# EAGLE design BTIR-v20 (EAGLE 4.16)
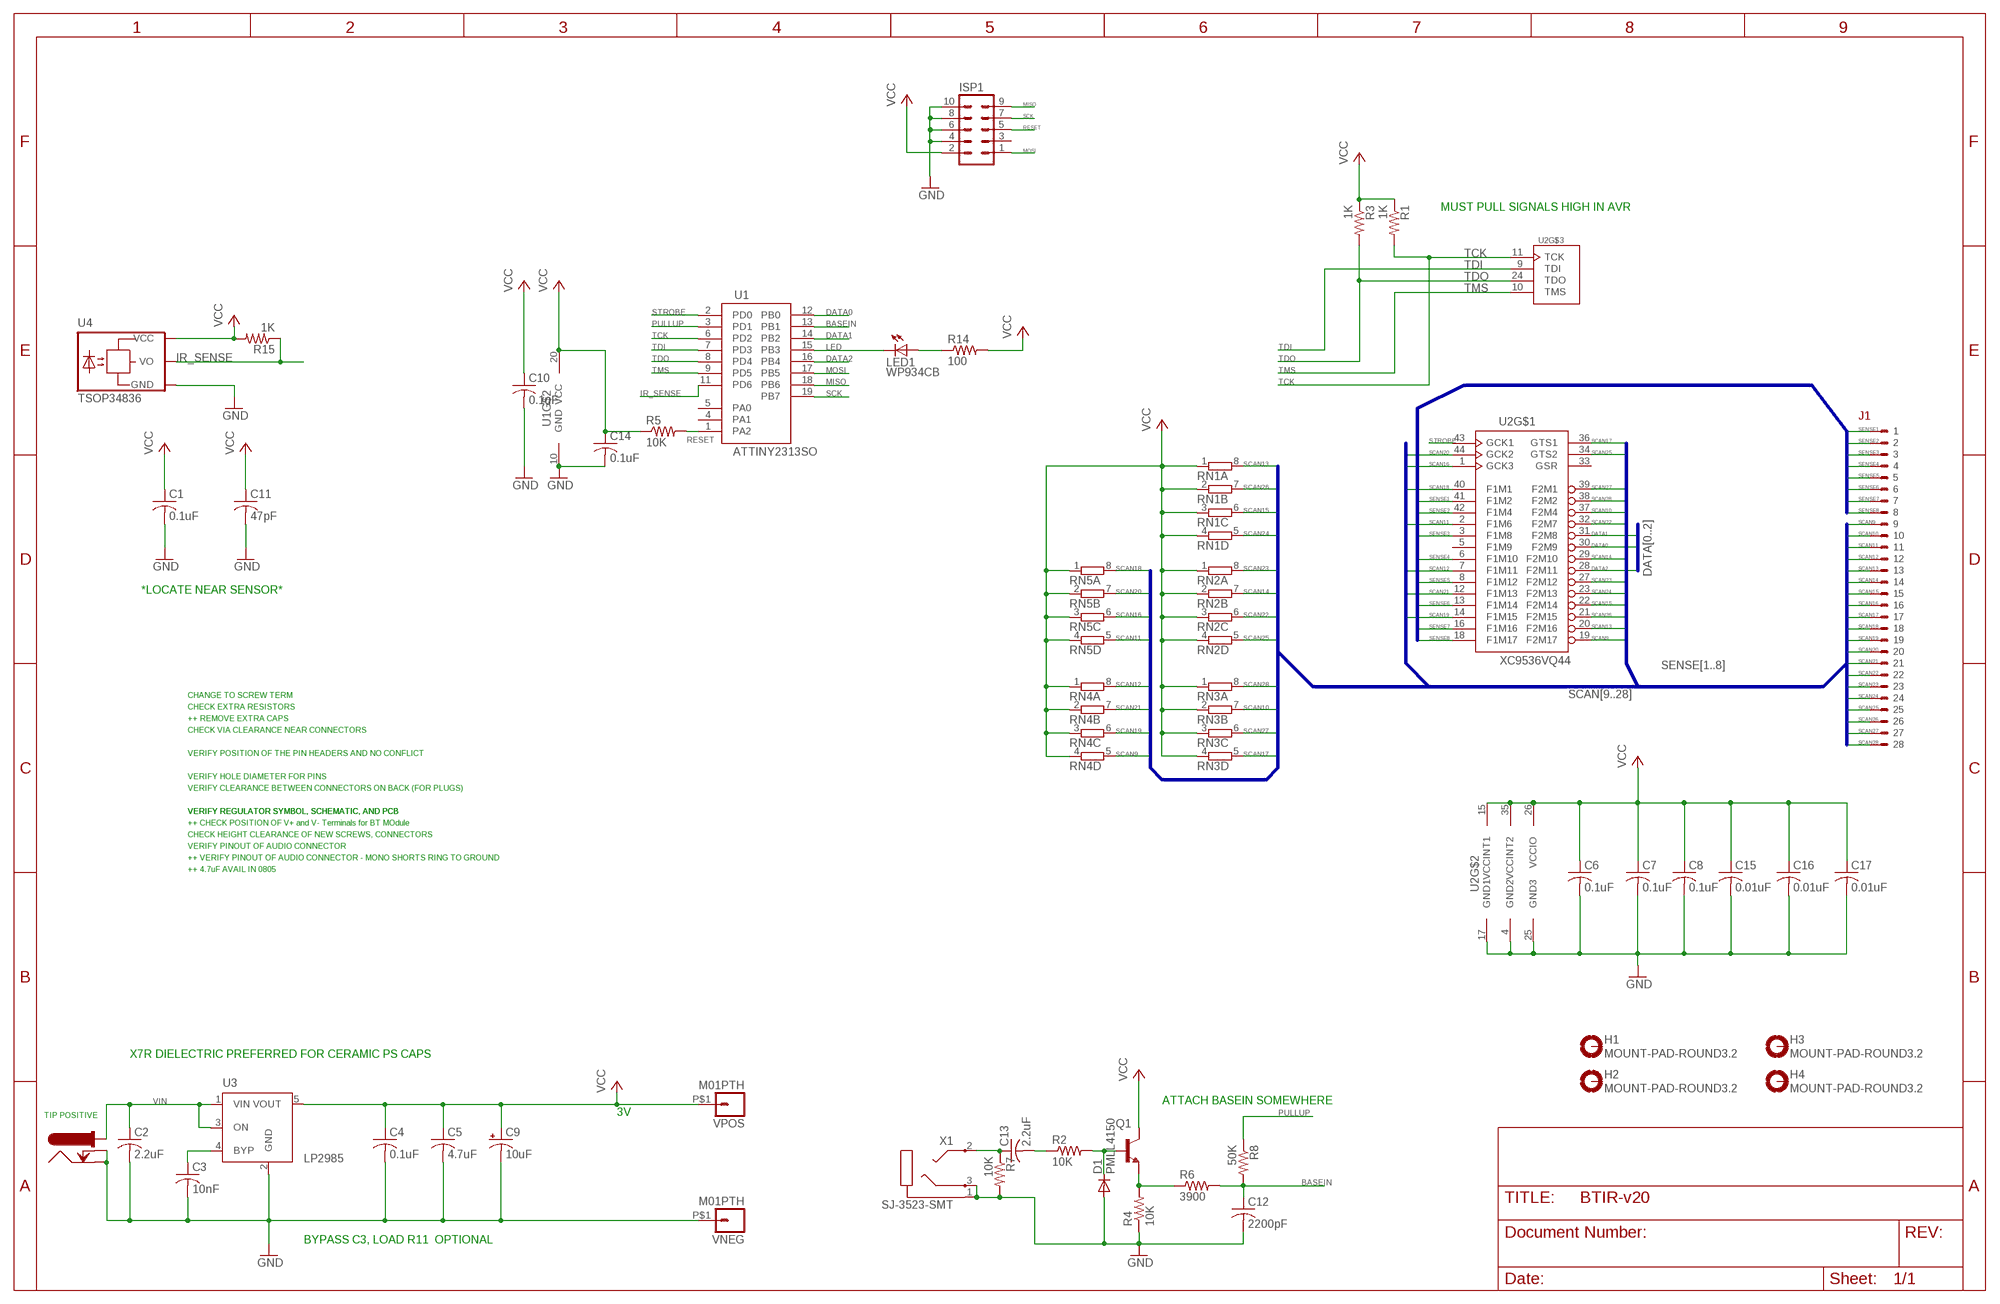
[diagram p0: schematic, sheet 1]

## Parts
C1  0.1uF  C-USC0805  [C0805]
C2  2.2uF  C-USC0805  [C0805]
C3  10nF  C-USC0805  [C0805]
C4  0.1uF  C-USC0805  [C0805]
C5  4.7uF  C-USC0805  [C0805]
C6  0.1uF  C-USC0805  [C0805]
C7  0.1uF  C-USC0805  [C0805]
C8  0.1uF  C-USC0805  [C0805]
C9  10uF  CPOL-USB  [PANASONIC_B]
C10  0.1uF  C-USC0805  [C0805]
C11  47pF  C-USC0805  [C0805]
C12  2200pF  C-USC0805  [C0805]
C13  2.2uF  C-USC0805  [C0805]
C14  0.1uF  C-USC0805  [C0805]
C15  0.01uF  C-USC0805  [C0805]
C16  0.01uF  C-USC0805  [C0805]
C17  0.01uF  C-USC0805  [C0805]
D1  PMLL4150  [SOD80C]
H1  MOUNT-PAD-ROUND3.2  [3,2-PAD]
H2  MOUNT-PAD-ROUND3.2  [3,2-PAD]
H3  MOUNT-PAD-ROUND3.2  [3,2-PAD]
H4  MOUNT-PAD-ROUND3.2  [3,2-PAD]
ISP1  MA05-2  [MA05-2]
J0  KOBICONN_163-021X-E  [KOBICONN_163-021X-E]
J1  MOLEX_52271-2879REV  [52271-2879]
LED1  WP934CB  [WP934CB]
Q1  TRANSISTOR_NPNSOT23  [SOT23]
R1  1K  R-US_R0805  [R0805]
R2  10K  R-US_R0805  [R0805]
R3  1K  R-US_R0805  [R0805]
R4  10K  R-US_R0805  [R0805]
R5  10K  R-US_R0805  [R0805]
R6  3900  R-US_R0805  [R0805]
R7  10K  R-US_R0805  [R0805]
R8  50K  R-US_R0805  [R0805]
R14  100  R-US_R0805  [R0805]
R15  1K  R-US_R0805  [R0805]
RN1  4R-N0603-ARC  [0603-ARC]
RN2  4R-N0603-ARC  [0603-ARC]
RN3  4R-N0603-ARC  [0603-ARC]
RN4  4R-N0603-ARC  [0603-ARC]
RN5  4R-N0603-ARC  [0603-ARC]
U1  ATTINY2313SO  [SOIC20S]
U2  XC9536VQ44  [VQ44]
U3  LP2985  [SOT23-5]
U4  TSOP34836  TSOP382XX  [VISHAY_TSOP_IR_LEADED]
VNEG  M01PTH  M01  [MACHINE_PIN_LARGE_RING]
VPOS  M01PTH  M01  [MACHINE_PIN_LARGE_RING]
X1  SJ-3523-SMT  [SJ-3523-SMT]

## Nets
BASEIN: C12.1 R6.2 R8.2 U1.13(PB1)
DATA0: U1.12(PB0) U2.30(F2M9)
DATA1: U1.14(PB2) U2.31(F2M8)
DATA2: U1.16(PB4) U2.28(F2M11)
GND: C1.2 C2.2 C3.2 C4.2 C5.2 C6.2 C7.2 C8.2 C9.- C10.2 C11.2 C12.2 C14.2 C15.2 C16.2 C17.2 D1.A ISP1.4 ISP1.6 ISP1.8 ISP1.10 J0.BARREL_2(BARREL) J0.SHUNT_1(SHUNT) R4.1 R7.2 U1.10(GND) U2.4(GND2) U2.17(GND1) U2.25(GND3) U3.2(GND) U4.2(GND) VNEG.P$1 X1.1(EARTH) X1.3(RING)
IR_SENSE: R15.1 U1.11(PD6) U4.1(VO)
LED: LED1.K(C) U1.15(PB3)
MISO: ISP1.9 U1.18(PB6)
MOSI: ISP1.1 U1.17(PB5)
N$1: C3.1 U3.4(BYP)
N$3: LED1.A R14.1
N$4: D1.C Q1.1(B) R2.2
N$5: C13.1 R7.1 X1.2(TIP)
N$6: Q1.2(E) R4.2 R6.1
N$7: C13.2 R2.1
PULLUP: R8.1 U1.3(PD1)
RESET: ISP1.5 R5.2 U1.1(PA2)
SCAN9: J1.20 RN4.5 U2.19(F2M17)
SCAN10: J1.19 RN3.7 U2.37(F2M4)
SCAN11: J1.18 RN5.5 U2.2(F1M6)
SCAN12: J1.17 RN4.8 U2.7(F1M11)
SCAN13: J1.16 RN1.8 U2.20(F2M16)
SCAN14: J1.15 RN2.7 U2.29(F2M10)
SCAN15: J1.14 RN1.6 U2.22(F2M14)
SCAN16: J1.13 RN5.6 U2.1(GCK3)
SCAN17: J1.12 RN3.5 U2.36(GTS1)
SCAN18: J1.11 RN5.8 U2.40(F1M1)
SCAN19: J1.10 RN4.6 U2.14(F1M15)
SCAN20: J1.9 RN5.7 U2.44(GCK2)
SCAN21: J1.8 RN4.7 U2.12(F1M13)
SCAN22: J1.7 RN2.6 U2.32(F2M7)
SCAN23: J1.6 RN2.8 U2.27(F2M12)
SCAN24: J1.5 RN1.5 U2.23(F2M13)
SCAN25: J1.4 RN2.5 U2.34(GTS2)
SCAN26: J1.3 RN1.7 U2.21(F2M15)
SCAN27: J1.2 RN3.6 U2.39(F2M1)
SCAN28: J1.1 RN3.8 U2.38(F2M2)
SCK: ISP1.7 U1.19(PB7)
SENSE1: J1.28 U2.41(F1M2)
SENSE2: J1.27 U2.42(F1M4)
SENSE3: J1.26 U2.3(F1M8)
SENSE4: J1.25 U2.6(F1M10)
SENSE5: J1.24 U2.8(F1M12)
SENSE6: J1.23 U2.13(F1M14)
SENSE7: J1.22 U2.16(F1M16)
SENSE8: J1.21 U2.18(F1M17)
STROBE: U1.2(PD0) U2.43(GCK1)
TCK: R1.2 U1.6(PD2) U2.11(TCK)
TDI: U1.7(PD3) U2.9(TDI)
TDO: R3.2 U1.8(PD4) U2.24(TDO)
TMS: U1.9(PD5) U2.10(TMS)
VCC: C1.1 C4.1 C5.1 C6.1 C7.1 C8.1 C9.+ C10.1 C11.1 C14.1 C15.1 C16.1 C17.1 ISP1.2 Q1.3(C) R1.1 R3.1 R5.1 R14.2 R15.2 RN1.1 RN1.2 RN1.3 RN1.4 RN2.1 RN2.2 RN2.3 RN2.4 RN3.1 RN3.2 RN3.3 RN3.4 RN4.1 RN4.2 RN4.3 RN4.4 RN5.1 RN5.2 RN5.3 RN5.4 U1.20(VCC) U2.15(VCCINT1) U2.26(VCCIO) U2.35(VCCINT2) U3.5(VOUT) U4.3(VCC) VPOS.P$1
VIN: C2.1 J0.PIN_3(PIN) U3.1(VIN) U3.3(ON)
Unconnected: H1.B3,2(MOUNT) H2.B3,2(MOUNT) H3.B3,2(MOUNT) H4.B3,2(MOUNT) ISP1.3 U1.4(PA1) U1.5(PA0) U2.5(F1M9) U2.33(GSR)

## Buses
SENSE[1..8]
SCAN[9..28]
DATA[0..2]

## Notes on the sheet
- MUST PULL SIGNALS HIGH IN AVR
- *LOCATE NEAR SENSOR*
- CHANGE TO SCREW TERM
- CHECK EXTRA RESISTORS
- ++ REMOVE EXTRA CAPS
- CHECK VIA CLEARANCE NEAR CONNECTORS
- VERIFY POSITION OF THE PIN HEADERS AND NO CONFLICT
- VERIFY HOLE DIAMETER FOR PINS
- VERIFY CLEARANCE BETWEEN CONNECTORS ON BACK (FOR PLUGS)
- VERIFY REGULATOR SYMBOL, SCHEMATIC, AND PCB | VERIFY REGULATOR SYMBOL, SCHEMATIC, AND PCB
- ++ CHECK POSITION OF V+ and V- Terminals for BT MOdule
- CHECK HEIGHT CLEARANCE OF NEW SCREWS, CONNECTORS
- VERIFY PINOUT OF AUDIO CONNECTOR
- ++ VERIFY PINOUT OF AUDIO CONNECTOR - MONO SHORTS RING TO GROUND
- ++ 4.7uF AVAIL IN 0805
- X7R DIELECTRIC PREFERRED FOR CERAMIC PS CAPS
- ATTACH BASEIN SOMEWHERE
- 3V
- TIP POSITIVE
- BYPASS C3, LOAD R11  OPTIONAL

## Library data of the parts
C1-C8 C10-C17 = rcl:C-US: CAPACITOR, American symbol
C9 = rcl:CPOL-US: POLARIZED CAPACITOR, American symbol
D1 = diode:PMLL4150: DIODE high speed
H1-H4 = holes:MOUNT-PAD-ROUND: MOUNTING PAD, round
ISP1 = con-lstb:MA05-2: PIN HEADER
J0 = ayman:KOBICONN_163-021X-E: Kobiconn laptop connector. NOTE: This connector is odd in that the insertion of the connector disconnects the shunt from the pin. With no plug inserted, the PIN is connected to the shunt. With plug inserted, the shunt is disconnected.
J1 = ayman:MOLEX_52271-2879
LED1 = ayman:WP934CB: Kingbright WP934CB Right Angle LED In plastic housing. 7.3mm height
Q1 = SparkFunEagle-6-6-07:TRANSISTOR_NPN: Transistor NPN BJT configuration in SOT23 package. MMBT2222 is the common NPN we use. Double check BCE configuration again layout.
R1-R8 R14 R15 = rcl:R-US_: RESISTOR, American symbol
RN1-RN5 = resistor-dil:4R-N: Array Chip Resistor Source: RS Component / Phycomp
U1 = ayman:ATTINY2313
U2 = ayman:XC9536
U3 = ayman:LP2985: Linear voltage regulators, 150mA, micropower, LDO up to 16V Vin SOT23-5 Package
U4 = ayman:TSOP382XX
VNEG VPOS = ayman:M01: "Mill-Max Machine Pin 316 Series"
X1 = con-cuistack:SJ-3523: 3.5 Stereo audio jack (SMT)

## Board
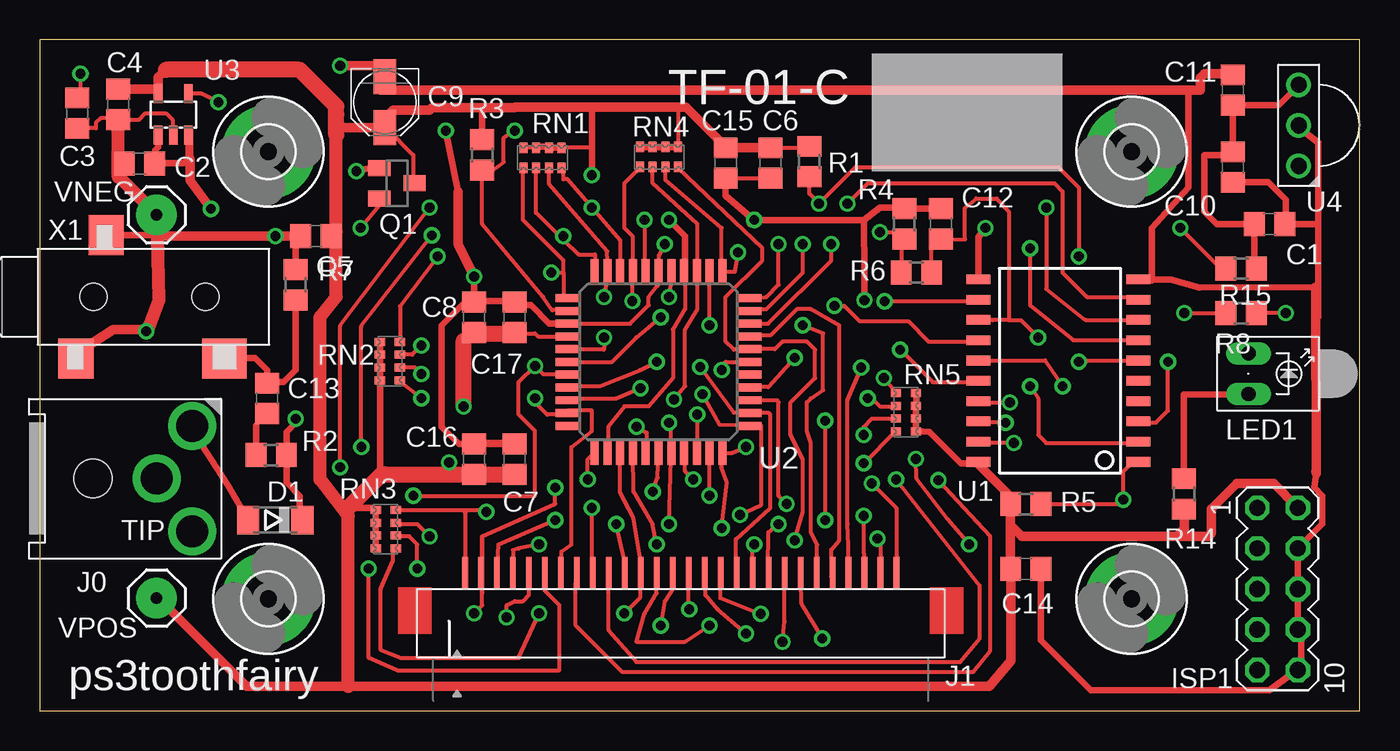
[diagram p1: board, top side]
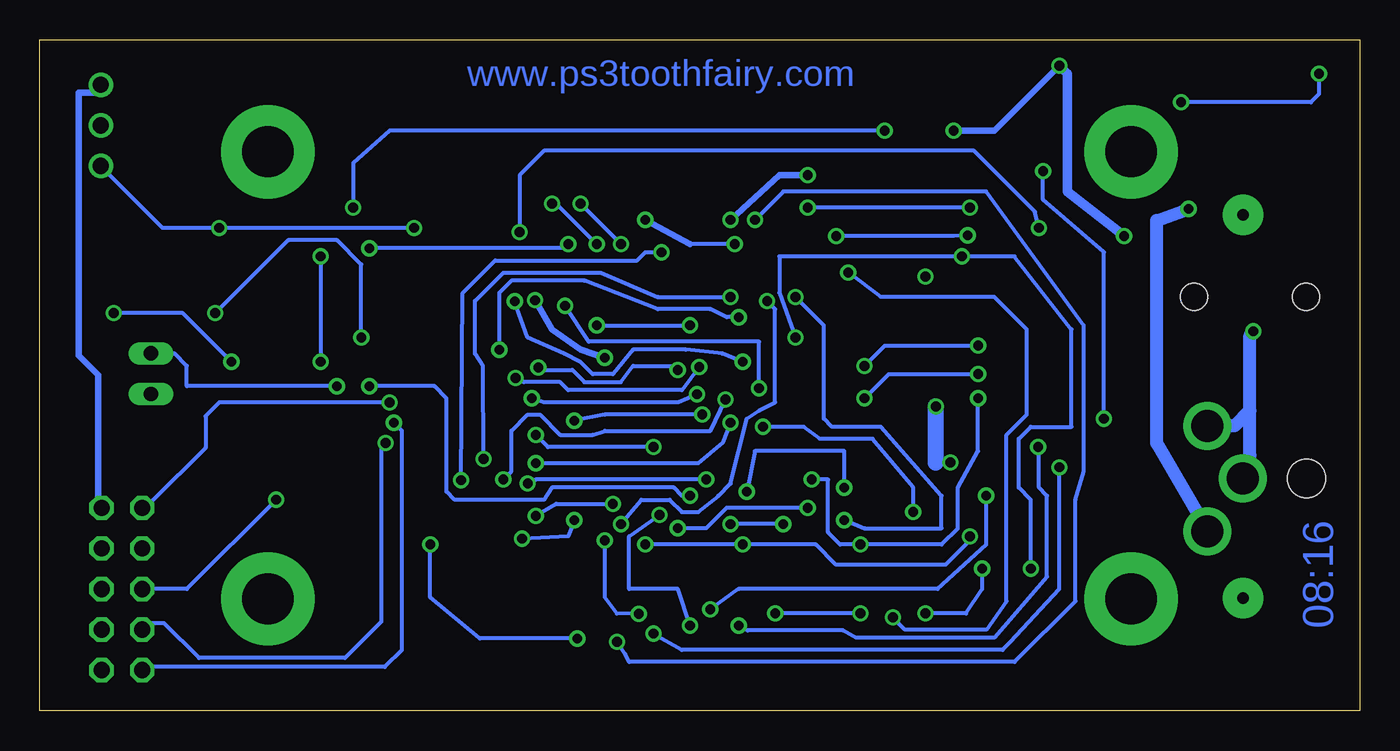
[diagram p2: board, bottom side, seen from below]

Size 82.6 x 42 mm. Coordinates in mm from the lower left corner, seen from the top.
Outline: 0,0 82.6,0 82.6,42 0,42 0,0
Copper layers (1*16): Top 0.035mm / dielectric 1.5mm / Bottom 0.035mm
Design rules "default": minimum track width 10mil, minimum drill 24mil, track to track 8mil, track to pad 8mil, pad to pad 8mil, via to via 8mil, smd to smd 8mil, copper to edge 40mil, drill to drill 8mil, minimum pad ring 10mil, minimum via ring 8mil, stop-mask expansion 4mil, vias tented up to drill 0mil, thermal gap 10mil

### Footprints (pad centres in the part's own frame; a part is rotated, then mirrored left to right if it is on the bottom)
C0805 = smd 1.3 x 1.5: 1 -0.95,0; 2 0.95,0
PANASONIC_B = smd 2.2 x 1.4: + 1.6,0; - -1.6,0
SOD80C = smd 1.4 x 1.8: A 1.7,0; C -1.7,0
3,2-PAD = drill 3.2 pad 5.842 round: B3,2 0,0
MA05-2 = drill 1.016 octagon: 1 -5.08,-1.27; 2 -5.08,1.27; 3 -2.54,-1.27; 4 -2.54,1.27; 5 0,-1.27; 6 0,1.27; 7 2.54,-1.27; 8 2.54,1.27; 9 5.08,-1.27; 10 5.08,1.27
KOBICONN_163-021X-E = drill 2 round: BARREL_2 3,0; PIN_3 5.2,-3.3; SHUNT_1 5.2,3.3 | hole 2.4: -1,0
52271-2879 = smd 0.35 x 2: 1 -30,2; 2 -29,2; 3 -28,2; 4 -27,2; 5 -26,2; 6 -25,2; 7 -24,2; 8 -23,2; 9 -22,2; 10 -21,2; 11 -20,2; 12 -19,2; 13 -18,2; 14 -17,2; 15 -16,2; 16 -15,2; 17 -14,2; 18 -13,2; 19 -12,2; 20 -11,2; 21 -10,2; 22 -9,2; 23 -8,2; 24 -7,2; 25 -6,2; 26 -5,2; 27 -4,2; 28 -3,2
WP934CB = drill 0.9 long: A -1.27,0; K 1.27,0
SOT23 = smd 1 x 1.4: 1 -0.95,-1.1; 2 0.95,-1.1; 3 0,1.1
R0805 = smd 1.3 x 1.5: 1 -0.95,0; 2 0.95,0
0603-ARC = smd 0.5 x 0.65: 1 -1.2,-0.625; 2 -0.4,-0.625; 3 0.4,-0.625; 4 1.2,-0.625; 5 1.2,0.625; 6 0.4,0.625; 7 -0.4,0.625; 8 -1.2,0.625
SOIC20S = smd 0.6 x 1.5: 1 -5.715,-5; 2 -4.445,-5; 3 -3.175,-5; 4 -1.905,-5; 5 -0.635,-5; 6 0.635,-5; 7 1.905,-5; 8 3.175,-5; 9 4.445,-5; 10 5.715,-5; 11 5.715,5; 12 4.445,5; 13 3.175,5; 14 1.905,5; 15 0.635,5; 16 -0.635,5; 17 -1.905,5; 18 -3.175,5; 19 -4.445,5; 20 -5.715,5
VQ44 = smd 1.5 x 0.5: 1 -5.7,4; 2 -5.7,3.2; 3 -5.7,2.4; 4 -5.7,1.6; 5 -5.7,0.8; 6 -5.7,0; 7 -5.7,-0.8; 8 -5.7,-1.6; 9 -5.7,-2.4; 10 -5.7,-3.2; 11 -5.7,-4; 23 5.7,-4; 24 5.7,-3.2; 25 5.7,-2.4; 26 5.7,-1.6; 27 5.7,-0.8; 28 5.7,0; 29 5.7,0.8; 30 5.7,1.6; 31 5.7,2.4; 32 5.7,3.2; 33 5.7,4 | smd 0.5 x 1.5: 12 -4,-5.7; 13 -3.2,-5.7; 14 -2.4,-5.7; 15 -1.6,-5.7; 16 -0.8,-5.7; 17 0,-5.7; 18 0.8,-5.7; 19 1.6,-5.7; 20 2.4,-5.7; 21 3.2,-5.7; 22 4,-5.7; 34 4,5.7; 35 3.2,5.7; 36 2.4,5.7; 37 1.6,5.7; 38 0.8,5.7; 39 0,5.7; 40 -0.8,5.7; 41 -1.6,5.7; 42 -2.4,5.7; 43 -3.2,5.7; 44 -4,5.7
SOT23-5 = smd 0.55 x 1.2: 1 -0.95,-1.3; 2 0,-1.3; 3 0.95,-1.3; 4 0.95,1.3; 5 -0.95,1.3
VISHAY_TSOP_IR_LEADED = drill 1.016 round: 1 -2.54,0; 2 0,0; 3 2.54,0
MACHINE_PIN_LARGE_RING = drill 0.711 pad 2.54 round: P$1 0,0
SJ-3523-SMT = smd 2.5 x 2.2: 1 3.85,-4.6; 3 -3.85,-2.7 | smd 2.5 x 2.8: 2 3.85,4.7 | hole 1.7: 0,-3.5; 0,3.5

### Placement (x,y rotation side)
C1  76.96,30.48 0 top
C2  6.23,34.26 180 top
C3  2.34,37.41 270 top
C4  4.91,37.96 270 top
C5  17.27,29.72 180 top
C6  45.72,34.29 270 top
C7  29.72,15.75 90 top
C8  27.18,24.64 90 top
C9  21.59,38.1 270 top
C10  74.68,34.04 270 top
C11  74.68,38.86 90 top
C12  56.39,30.48 90 top
C13  14.22,19.56 270 top
C14  61.71,8.87 0 top
C15  42.93,34.29 270 top
C16  27.18,15.75 90 top
C17  29.72,24.64 90 top
D1  14.73,11.94 180 top
H1  14.3,35 0 top
H2  14.3,7 0 top
H3  68.33,7 0 top
H4  68.33,35 0 top
ISP1  77.47,7.62 270 top
J0  4.32,14.53 0 top
J1  56.61,6.62 0 top
LED1  75.64,21.1 90 top
Q1  22.35,33.02 270 top
R1  48.16,34.39 270 top
R2  14.48,16 0 top
R3  27.69,34.8 270 top
R4  54.1,30.48 270 top
R5  61.71,12.94 0 top
R6  54.86,27.43 0 top
R7  16,26.67 90 top
R8  75.18,24.89 180 top
R14  71.61,13.58 270 top
R15  75.18,27.69 0 top
RN1  31.46,34.62 180 top
RN2  21.9,21.89 270 top
RN3  21.65,11.36 270 top
RN4  38.75,34.67 180 top
RN5  54.21,18.68 90 top
U1  63.75,21.29 90 top
U2  38.72,21.84 180 top
U3  8.35,37.33 0 top
U4  78.79,36.65 90 top
VNEG  7.3,31.05 0 top
VPOS  7.3,7.05 0 top
X1  6.85,25.92 270 top

### Tracks (layer width: path | path; a pad name or v marks a point on that pad's centre or on a via)
BASEIN  (via drill 0.61)
  Top 0.254: R6.2 55.81,28.89 56.39,29.46 | 60.64,24.45 60.64,31.24 59.88,32.07 58.61,32.07 57.91,31.5 57.91,29.53 56.39,29.46 | 56.39,29.46 C12.1 | U1.13 59.63,24.45 60.64,24.45 | 60.64,24.45 61.4,24.45 v62.48,23.37 | R8.2 74.17,24.89 v71.63,24.89
  Bottom 0.254: v62.48,23.37 62.48,27.94 64.01,29.46 67.06,29.46 v71.63,24.89
DATA0  (via drill 0.61)
  Top 0.254: v38.61,21.84 37.59,21.34 35.05,20.32 33.53,20.32 U2.30 | 58.75,25.73 U1.12 58.75,25.84 58.67,25.91 58.42,25.65 52.83,25.65 v52.88,25.63
  Bottom 0.254: v52.88,25.63 52.07,23.37 49.78,22.35 48.77,21.84 48.01,21.08 46.74,21.08 45.47,22.61 42.16,22.61 39.88,22.35 v38.61,21.84
DATA1  (via drill 0.61)
  Top 0.254: U2.31 33.53,19.56 36.07,19.56 v37.59,20.19 | v49.73,25.35 50.34,25.35 51.31,24.38 54.36,24.38 55.63,23.11 58.67,23.11 U1.14
  Bottom 0.254: v49.73,25.35 48.26,23.11 37.59,23.11 v37.59,20.19
DATA2  (via drill 0.61)
  Top 0.254: 32.51,21.84 U2.28 33.53,21.84 35.81,21.84 37.34,23.37 v38.86,24.64 | v53.85,22.61 55.88,20.57 58.67,20.57 U1.16
  Bottom 0.254: v38.86,24.64 39.62,24.64 40.64,25.15 43.94,25.15 48.51,26.92 53.09,26.92 53.85,26.16 v53.85,22.61
GND  (via drill 0.61)
  Top 0.254: 26.52,17.07 C16.2 27.69,16.76 | 26.52,25.3 C8.2 27.69,25.65 | U2.4 44.58,20.26 45.59,20.26 v47.24,22.1 | C7.2 29.21,16.76 | 29.21,25.65 C17.2 29.72,25.65 29.97,25.4 30.23,25.4 | 32.96,24.26 U2.25 36.94,24.24 38.1,25.4 38.1,25.91 38.67,26.61 38.67,27.62 38.72,27.57 U2.17 38.73,28.19 38.73,28.51 v39.12,29.21 | 45.91,33.34 C6.2 | C15.2 45.91,33.34 | 45.91,33.34 45.97,33.27 | C3.2 3.5,36.46 3.5,36.8 3.8,37.1 4.8,37.1 C4.2 6.21,37.01 6.6,37.4 7.9,37.4 8.3,37 8.3,36 8.33,36.03 U3.2 | 53.85,31.5 53.91,31.43 R4.1 | C12.2 56.39,31.5 56.32,31.43 | C9.- 21.59,38.86
  Top 0.406: 78.94,3.66 78.94,3.05 ISP1.10 | 29.21,16.76 27.69,16.76 | 27.69,25.65 29.21,25.65 | 30.23,25.4 30.73,25.4 31.88,24.26 32.96,24.26 32.97,24.24 U2.25 | 78.94,3.66 78.94,4.88 ISP1.8 ISP1.6 ISP1.4 80.26,11.68 80.26,13.46 79.76,13.97 79.88,14.86 79.76,14.99 | v27.18,27.18 27.18,26.16 | C7.2 26.23,16.7 25.15,17.78 25.15,24.13 27.18,26.16 | 27.18,26.16 C8.2 | C15.2 42.93,32.26 v44.7,30.73 | v51.61,25.7 51.61,27.38 51.56,30.73 | v44.7,30.73 44.45,30.48 | v44.7,30.73 51.56,30.73 | 78.94,3.66 78.94,2.74 76.96,1.27 65.79,1.27 62.66,4.4 C14.2 | v25.4,36.32 26.16,32.51 | 2.29,22.35 X1.1 | 51.56,30.73 52.58,31.5 53.85,31.5 | R4.1 56.32,31.43 | J0.SHUNT_1 9.45,17.83 9.4,17.78 11.76,14.15 D1.A | 78.79,36.63 U4.2 78.74,36.58 80.01,35.56 80.01,30.48 | 77.98,30.48 78.74,30.48 | 80.01,30.48 80.01,24.64 79.86,26.52 72.56,26.5 70.78,27.01 U1.10 69.6,26.92 69.6,30.23 71.88,32.77 71.88,38.86 | 80.01,30.48 77.98,30.48 | C10.2 76.9,33.09 77.98,32 77.98,30.48 | 77.98,30.48 C1.2 | X1.3 7.57,29.77 7.62,29.72 | 16,29.72 R7.2
  Top 0.61: 79.86,26.52 79.88,14.86 | 21.34,38.86 21.59,38.86 71.88,38.86 72.64,38.86 72.64,39.62 72.9,39.88 74.68,39.88 C11.2 | 26.16,32.51 26.16,29.21 v27.18,27.18 | 7.37,29.72 7.62,29.72 v14.73,29.72 16,29.72 C5.2 | 2.29,22.35 4.57,23.88 6.86,23.88 v6.65,23.75 | C9.- 21.59,39.88 21.08,40.39 v18.8,40.39
  Top 0.813: 4.91,34.2 4.91,33.39 4.96,33.39 VNEG.P$1 7.37,30.99 7.37,29.72 | 4.91,34.2 C4.2 | v6.65,23.75 6.7,23.7 7.46,25.7 7.37,29.72 | 4.91,34.2 4.9,34.2 4.96,34.26 C2.2 | 7.37,29.72 7.35,29.72
  Bottom 0.254: v39.12,29.21 41.91,29.21
  Bottom 0.406: 41.91,29.21 v44.7,30.73 | v47.24,22.1 48.77,22.61 50.55,23.88 v51.61,25.7 | v25.4,36.32 22.86,36.32 v18.8,40.39
  Bottom 0.61: v18.8,40.39 18.29,39.88 18.29,32.51 18.3,32.5 v14.73,29.72
  Bottom 0.813: J0.BARREL_2 7.32,14.43 7.37,14.22 6.86,16 6.86,18.8 | 6.86,18.8 6.86,23.5 v6.65,23.75 | 6.86,18.8 7.82,17.83 9.34,17.83 9.4,17.78 9.45,17.83 J0.SHUNT_1
IR_SENSE  (via drill 0.61)
  Top 0.254: R15.1 73.91,27.69 v71.37,30.23
  Top 0.406: U1.11 58.75,29.65 v59.18,30.23
  Bottom 0.254: v59.18,30.23 v71.37,30.23 74.93,30.23 78.79,34.09 U4.1
LED  (via drill 0.61)
  Top 0.254: U1.15 62.91,21.93 v64.01,20.32
  Bottom 0.254: v64.01,20.32 73.41,20.32 73.41,21.59 74.17,22.35 75.69,22.35 75.67,22.38 LED1.K
MISO  (via drill 0.61)
  Top 0.254: U1.18 58.75,18.11 58.67,18.03 v60.45,18.03
  Bottom 0.254: ISP1.9 75.59,2.74 61.01,2.74 59.94,3.81 59.94,17.53 v60.45,18.03
MOSI  (via drill 0.61)
  Top 0.254: U1.17 58.84,19.39 58.93,19.3 v60.71,19.3
  Bottom 0.254: ISP1.1 75.59,13.11 72.24,16.46 72.24,18.44 71.37,19.3 v60.71,19.3
N$1  (via drill 0.61)
  Top 0.254: U3.4 10.14,38.63 v11.18,38.1 | C3.1 2.55,38.87 2.54,38.86 v2.54,39.88
  Bottom 0.254: v11.18,38.1 3.05,38.1 2.54,38.61 v2.54,39.88
N$3
  Top 0.406: LED1.A 75.67,19.83 75.69,19.81 71.61,19.79 R14.1
N$4  (via drill 0.61)
  Top 0.254: 15.43,17.46 15.49,17.53
  Top 0.406: Q1.1 20.64,33.97 v19.81,33.78 | 15.49,17.53 16,18.03 v16,18.29 | 15.43,17.46 R2.2 15.43,14.29 16.26,13.46 16.26,11.94 D1.C
  Bottom 0.254: v16,18.29 16,28.7 19.81,32 v19.81,33.78
N$5
  Top 0.406: X1.2 11.65,22.07 11.68,22.1 13.46,22.1 14.22,21.34 C13.1 14.04,20.51 13.97,20.57 15.24,20.57 16,21.34 R7.1
N$6  (via drill 0.61)
  Top 0.254: R6.1 53.91,29.4 53.85,29.46 53.91,29.53 R4.2 54.1,29.46 53.59,29.97 v52.58,29.97 | Q1.2 21.25,31.67 v20.07,30.23
  Bottom 0.254: v20.07,30.23 20.32,31.24 24.13,35.05 51.05,35.05 52.58,33.53 v52.58,29.97
N$7
  Top 0.254: C13.2 14.22,18.54 13.53,17.85 | R2.1 13.46,16 13.53,16.07
  Top 0.406: 13.53,16.07 13.53,17.85
PULLUP  (via drill 0.61)
  Top 0.254: v70.61,21.84 70.61,18.8 69.85,18.03 68.83,18.03 U1.3 | v77.98,24.89 R8.1
  Bottom 0.254: v77.98,24.89 73.66,24.89 v70.61,21.84
RESET  (via drill 0.61)
  Top 0.254: U1.1 68.41,15.58 67.82,14.99 v67.82,13.21 67.55,12.94 R5.2
  Bottom 0.254: ISP1.5 73.41,7.62 v67.82,13.21
SCAN9  (via drill 0.61)
  Top 0.254: v37.08,25.65 37.08,26.92 U2.19 37.12,29.68 36.58,30.23 36.58,33.02 37.59,34.04 RN4.5 | v46.23,11.68 45.59,11.18 45.57,9.02 J1.20
  Bottom 0.254: v46.23,11.68 44.96,13.21 43.18,13.21 42.42,12.45 41.4,12.45 40.13,13.46 39.37,14.22 38.35,18.29 37.59,18.8 36.58,19.3 36.58,25.15 v37.08,25.65
SCAN10  (via drill 0.61)
  Top 0.254: v38.61,10.41 38.35,11.68 37.15,13.72 U2.37 | v44.7,10.41 44.58,10.16 J1.19 | RN3.7 22.35,11.68 23.62,11.68 v24.38,10.92
  Bottom 0.254: v44.7,10.41 v38.61,10.41 34.04,10.41 32.77,9.14 25.91,9.14 24.38,10.67 v24.38,10.92
SCAN11  (via drill 0.61)
  Top 0.254: J1.18 43.56,9.78 43.56,10.73 45.72,12.7 45.72,18.54 45.62,18.64 U2.2 44.54,18.64 44.58,18.61 | v52.83,20.83 RN5.5 | v41.34,21.53 43.43,18.67 44.58,18.61 | 44.58,18.61 44.64,18.54
  Bottom 0.254: v52.83,20.83 52.32,20.57 50.04,20.57 49.53,20.07 42.42,20.07 v41.34,21.53
SCAN12  (via drill 0.61)
  Top 0.254: v45.11,6.07 42.6,7.06 42.6,8.18 J1.17 | v47.24,10.67 47.75,12.45 47.75,15.75 46.99,17.27 46.99,19.3 48.51,20.83 48.51,22.61 48.01,23.11 46.48,23.11 46.01,22.64 U2.7 44.7,22.61 43.43,22.61 42.93,23.11 42.93,25.91 45.21,28.19 45.21,28.96 39.95,33.96 RN4.8
  Bottom 0.254: v47.24,10.67 47.24,7.11 46.48,6.1 v45.11,6.07
SCAN13  (via drill 0.61)
  Top 0.254: v24.38,31.5 18.8,24.13 v18.8,15.24 | v44.2,4.83 42.42,6.35 41.66,7.24 41.66,8.64 41.64,8.62 J1.16 | 32.64,34.04 32.62,34.04 RN1.8 32.66,34.02 32.64,34.04 | 32.64,34.04 32.77,34.04 | U2.20 36.32,27.94 36.32,29.46 v34.54,31.5 33.02,33.27 32.77,33.27 32.77,33.91 32.64,34.04
  Bottom 0.254: v18.8,15.24 18.8,7.62 21.84,4.32 22.35,3.81 42.42,3.81 v44.2,4.83 | v24.38,31.5 v34.54,31.5
SCAN14  (via drill 0.61)
  Top 0.254: U2.29 32.81,21.04 32.77,21.08 31.5,21.08 v30.99,21.59 29.97,20.57 29.97,18.54 30.99,17.53 30.99,13.46 v23.37,13.46 | v40.64,6.35 40.61,6.83 40.64,8.64 J1.15 | RN2.7 23.3,22.29 v23.88,22.86
  Bottom 0.254: v23.88,22.86 29.72,22.86 v30.99,21.59 | v23.37,13.46 23.37,10.41 26.42,7.62 38.86,7.62 v40.64,6.35
SCAN15  (via drill 0.61)
  Top 0.254: v24.54,29.77 20.12,24.08 v20.12,16.51 | J1.14 39.62,7.92 39.62,7.62 39.12,6.86 v38.86,5.33 | U2.22 34.73,28.57 33.72,28.57 32.77,29.46 | RN1.6 31.05,33.86 31.05,31.18 32.77,29.46 | v32.77,29.72 32.77,29.46
  Bottom 0.254: v24.54,29.77 25.4,29.72 v32.77,29.72 | v38.86,5.33 38.3,5.03 32.31,5.03 31.5,4.57 22.86,4.57 19.56,8.38 19.56,13.46 20.07,13.97 20.07,16.51 v20.12,16.51
SCAN16  (via drill 0.61)
  Top 0.254: 43.94,17.78 U2.1 45.15,17.84 | J1.13 38.61,7.87 38.61,7.37 37.85,6.1 37.34,4.32 40.39,4.32 v41.91,5.33 | 45.15,17.84 45.15,12.89 v43.81,12.26 | v51.82,19.56 52.07,19.56 52.58,19.05 53.59,19.05 53.58,19.06 RN5.6 | 45.15,17.84 42.55,17.91 v41.47,19.81
  Bottom 0.254: v43.81,12.26 45.72,10.92 45.72,7.62 42.67,7.62 v41.91,5.33 | v41.47,19.81 42.67,19.3 51.05,19.3 v51.82,19.56
SCAN17  (via drill 0.61)
  Top 0.254: U2.36 36.32,15.49 36.32,13.65 37.15,12.06 37.59,9.4 J1.12 37.59,8.64 37.59,7.11 v36.58,6.1 | v31.24,6.1 29.97,3.3 22.61,3.3 21.34,3.81 21.34,7.62 22.1,9.4 22.1,9.91 22.35,10.16 RN3.5
  Bottom 0.254: v31.24,6.1 v36.58,6.1
SCAN18  (via drill 0.61)
  Top 0.254: v39.37,11.68 39.5,15.75 | v36.07,11.68 36.58,9.4 J1.11 | 39.5,15.75 U2.40 | 39.5,15.75 39.5,17.59 v39.37,18.03 | 53.58,17.52 53.59,17.53 | 53.58,17.52 RN5.8 | v51.56,15.49 53.58,17.52
  Bottom 0.254: v36.07,11.68 v39.37,11.68 | v39.37,18.03 39.88,16.76 41.4,15.49 v51.56,15.49
SCAN19  (via drill 0.61)
  Top 0.254: J1.10 35.6,8.43 35.6,5.04 37.34,3.05 57.61,3.05 58.83,4.52 58.83,7.82 53.65,14.43 v53.59,14.48 | RN4.6 38.35,33.02 41.15,30.48 41.15,27.69 41.12,27.66 U2.14 41.15,26.42 41.15,25.15 40.39,23.88 40.39,20.32 v39.69,19.49
  Bottom 0.254: v53.59,14.48 53.09,14.99 53.09,17.53 52.07,18.54 51.31,18.54 50.04,17.27 48.01,17.27 47.24,17.53 40.64,17.53 v39.69,19.49
SCAN20  (via drill 0.61)
  Top 0.254: v34.54,12.7 34.54,9.4 J1.9 | v42.67,11.43 42.99,14.29 42.67,15.24 42.67,15.49 U2.44 43.32,16.14 v44.2,16.51 | v51.56,17.27 51.56,17.78 52.07,18.29 53.59,18.29 RN5.7
  Bottom 0.254: v42.67,11.43 40.89,11.43 39.62,12.7 v34.54,12.7 | v44.2,16.51 50.8,16.51 v51.56,17.27
SCAN21  (via drill 0.61)
  Top 0.254: v56.24,14.43 59.49,10.92 59.49,3.76 58.42,2.44 36.42,2.44 33.53,5.33 33.53,7.92 J1.8 | RN4.7 39.15,33.24 42.67,30.23 42.67,27.43 42.72,27.48 | 42.72,27.48 U2.12 | 42.72,27.48 43.48,27.48 v43.69,28.7
  Bottom 0.254: v56.24,14.43 56.13,26.16 54.1,28.19 45.21,28.19 44.7,28.7 v43.69,28.7
SCAN22  (via drill 0.61)
  Top 0.254: J1.7 32.64,9.02 32.64,9.97 33.27,10.41 33.27,16.51 34.54,17.53 34.54,18.8 33.02,18.8 U2.32 32.51,18.54 31.75,18.54 30.99,19.3 v30.99,19.56 | RN2.6 23.47,21.49 v23.88,21.08
  Bottom 0.254: v23.88,21.08 29.46,21.08 v30.99,19.56
SCAN23  (via drill 0.61)
  Top 0.254: v35.31,23.37 35.31,22.61 33.53,22.61 U2.27 | v20.57,8.89 20.57,3.3 22.35,2.54 32.51,2.54 32.51,6.6 31.61,7.51 J1.6 | RN2.8 22.53,25.32 v24.89,28.45
  Bottom 0.254: v35.31,23.37 36.32,26.16 36.32,28.45 v24.89,28.45 21.59,28.45 18.03,23.88 18.03,17.78 20.57,17.78 21.34,17.02 21.34,13.97 20.57,13.21 v20.57,8.89
SCAN24  (via drill 0.61)
  Top 0.254: RN1.5 30.23,33.96 30.23,30.73 32.77,28.19 32.77,27.43 | U2.23 32.95,25.91 32.77,25.91 32.77,27.43 | v32,27.43 32.77,27.43 | J1.5 30.61,7.24 30.23,6.86 29.72,6.86 29.21,6.6 v29.21,5.84
  Bottom 0.254: v32,27.43 29.97,25.91 22.86,25.91 20.83,23.88 20.83,18.54 22.1,17.27 22.1,6.86 23.37,5.08 28.45,5.08 v29.21,5.84
SCAN25  (via drill 0.61)
  Top 0.254: 34.54,15.49 U2.34 34.72,16.18 | RN2.5 22.78,20.4 v23.88,19.56 | 34.72,16.18 34.8,16.26 | v34.29,14.48 34.29,15.75 34.72,16.18 | J1.4 29.61,10.05 29.97,10.16 v31.24,10.41
  Bottom 0.254: v34.29,14.48 33.27,14.48 33.27,11.18 32.51,10.41 v31.24,10.41 26.16,10.41 25.15,11.43 25.15,13.97 23.88,16.26 v23.88,19.56
SCAN26  (via drill 0.61)
  Top 0.254: v35.31,25.91 35.5,26.8 U2.21 35.56,27.5 | RN1.7 31.88,33.95 31.88,32.96 35.5,28.77 35.56,27.5 | 35.56,27.5 35.56,27.43 | J1.3 28.7,10.41 v32.26,11.94
  Bottom 0.254: v32.26,11.94 30.99,11.43 26.16,11.43 26.16,13.46 29.97,17.78 33.02,17.78 33.53,18.29 33.53,24.13 v35.31,25.91
SCAN27  (via drill 0.61)
  Top 0.254: v38.35,13.72 38.67,14.61 U2.39 | 27.69,9.4 J1.2 27.67,8.62 27.69,8.64 | 27.69,10.92 27.69,9.4 | 27.69,10.92 32.26,12.95 v32.26,13.97 | 27.69,9.4 27.69,7.37 | RN3.6 22.31,10.96 22.35,10.92 23.11,10.92 23.62,10.41 v23.62,8.89 | 27.69,10.92 27.69,6.6 v27.18,6.1
  Bottom 0.254: v38.35,13.72 37.85,16.26 32.26,16.26 v32.26,13.97 | v27.18,6.1 24.64,6.1 23.62,7.62 v23.62,8.89
SCAN28  (via drill 0.61)
  Top 0.254: v37.34,17.78 37.97,17.4 U2.38 | RN3.8 26.67,12.56 | 26.67,12.56 27.82,12.56 v27.94,12.45 | 26.67,12.56 26.67,12.45 26.61,12.39 J1.1
  Bottom 0.254: v37.34,17.78 34.8,17.78 33.78,17.02 30.48,17.02 27.94,13.97 v27.94,12.45
SCK  (via drill 0.61)
  Top 0.254: U1.19 58.75,16.84 58.67,16.76 v60.96,16.76
  Bottom 0.254: ISP1.7 75.59,5.49 74.83,5.49 72.64,3.3 63.5,3.3 61.21,5.59 61.21,16.51 v60.96,16.76
SENSE1  (via drill 0.61)
  Top 0.254: v40.89,14.48 40.39,14.99 40.39,15.49 U2.41 | J1.28 53.61,12.68 v52.07,14.22
  Bottom 0.254: v40.89,14.48 51.56,14.48 51.82,14.22 v52.07,14.22
SENSE2  (via drill 0.61)
  Top 0.254: v52.43,10.77 52.6,10.78 52.6,9.4 J1.27 | v49.15,18.16 v49.15,11.94 | U2.42 41.15,16.76 v41.15,18.54
  Bottom 0.254: v49.15,11.94 49.53,10.92 v52.43,10.77 | v41.15,18.54 47.24,18.54 v49.15,18.16
SENSE3  (via drill 0.61)
  Top 0.254: v51.56,12.19 51.56,9.96 51.64,9.47 J1.26 | 44.96,19.3 U2.3 46.13,19.43 46.23,19.3 46.23,13.46 v46.74,12.95
  Bottom 0.254: v46.74,12.95 50.29,12.95 v51.56,12.19
SENSE4  (via drill 0.61)
  Top 0.254: J1.25 50.6,9.45 50.6,10.36 50.55,11.68 50.55,19.46 v51.41,21.49 | v42.67,21.34 42.67,21.59 42.93,21.84 44.45,21.84 U2.6
  Bottom 0.254: v42.67,21.34 42.93,21.59 45.47,21.59 46.23,20.57 48.51,20.57 49.28,21.34 51.31,21.34 v51.41,21.49
SENSE5
  Top 0.254: 44.45,23.37 U2.8 44.42,23.46 44.45,23.5 45.72,23.5 47.37,25.15 48.26,25.15 50.04,24.13 50.04,10.67 49.53,10.08 49.55,8.36 J1.24
SENSE6  (via drill 0.61)
  Top 0.254: U2.13 41.91,27.43 v41.91,24.13 | v47.75,24.13 49.02,23.62 49.02,20.07 48.26,19.56 48.01,19.3 48.01,17.53 48.26,16.76 48.26,11.18 48.64,10.41 48.64,8.64 J1.23
  Bottom 0.254: v47.75,24.13 v41.91,24.13
SENSE7  (via drill 0.61)
  Top 0.254: v54.84,15.76 54.86,14.53 56.82,11.99 v58.17,10.41 | v48.97,4.52 47.68,6.71 47.62,8.15 J1.22 | v39.37,25.91 39.5,26.67 U2.16
  Bottom 0.254: v39.37,25.91 43.94,25.91 47.5,27.43 53.59,27.43 55.37,25.65 55.37,22.35 54.86,21.59 v54.84,15.76 | v48.97,4.52 55.07,4.52 58.17,7.11 v58.17,10.41
SENSE8  (via drill 0.61)
  Top 0.254: v37.85,30.73 37.85,28.19 U2.18 | v46.48,4.32 46.61,5.59 J1.21
  Bottom 0.254: v37.85,30.73 36.07,32.51 23.37,32.51 17.27,24.13 17.27,14.99 17.78,13.21 17.78,6.86 21.59,3.05 45.72,3.05 45.97,3.56 v46.48,4.32
STROBE  (via drill 0.61)
  Top 0.254: U2.43 41.92,13.73 v41.91,13.46 | v61.98,20.32 62.48,19.56 62.48,17.27 62.99,16.76 68.58,16.76 U1.2
  Bottom 0.254: v41.91,13.46 42.42,13.46 42.93,13.97 50.55,13.97 51.05,13.21 56.64,13.21 57.15,13.72 57.15,19.56 57.91,20.32 v61.98,20.32
TCK  (via drill 0.61)
  Top 0.254: U2.11 45.47,25.91 46.23,26.67 v46.23,29.21 | v65.02,21.84 65.11,21.93 U1.6 | U1.6 | U1.6 68.83,21.84 | v65.02,28.45 65.02,32.77 63.75,34.04 51.05,34.04 v48.77,31.75 48.16,32.36 R1.2
  Bottom 0.254: v46.23,29.21 v48.77,31.75 | v65.02,28.45 v65.02,21.84
TDI  (via drill 0.61)
  Top 0.254: v49.53,29.21 49.53,28.19 45.58,24.24 U2.9 | U1.7 64.69,23.2 61.98,25.4 v61.98,28.96
  Bottom 0.254: v61.98,28.96 49.78,28.96 v49.53,29.21
TDO  (via drill 0.61)
  Top 0.254: U1.8 68.83,24.38 | U1.8 | U1.8 65.45,24.47 62.99,26.42 v62.99,31.5 | v29.72,36.32 29.02,35.88 29.02,34.36 27.94,33.53 27.69,33.78 R3.2 | R3.2 27.69,34.04 | R3.2 27.69,30.48 31.5,25.91 32.07,25.08 32.89,25.08 32.96,25.02 32.98,25.04 U2.24
  Bottom 0.254: v62.99,31.5 62.99,34.29 60.71,36.32 v29.72,36.32
TMS  (via drill 0.61)
  Top 0.254: U2.10 44.96,25.15 45.47,25.15 47.75,27.43 v47.75,29.21 | U1.9 68.83,25.65 | U1.9 | U1.9 68.58,25.91 65.53,25.91 64.01,27.43 64.01,32.51 63.5,33.02 51.82,33.02 v50.55,31.75
  Bottom 0.254: v50.55,31.75 50.29,31.75 v47.75,29.21
VCC  (via drill 0.61)
  Top 0.254: 27.13,14.73 27.13,14.63 C16.1 27.69,14.73 29.21,14.73 C7.1 | 26.52,23.16 C8.1 27.69,23.62 | 25.6,14.73 25.6,14.63 | U2.35 35.56,16.76 35.56,17.78 36.58,19.05 38.1,19.05 39.62,20.83 39.62,23.88 40.39,25.15 40.39,26.92 U2.15 | 29.21,23.62 C17.1 30.23,23.62 30.99,23.62 31.18,23.43 32.96,23.43 33.02,23.37 U2.26 | R1.1 48.23,35.34 48.26,35.31 48.19,35.24 C6.1 | C9.+ 21.67,36.5 23.37,34.8 23.37,33.02 Q1.3 | 39.88,37.78 39.88,37.85 39.91,37.81 | 39.91,37.81 39.95,37.77 39.94,37.77 | RN1.3 31.05,35.24 30.99,35.31 30.93,35.24 RN1.4 | RN1.1 34.48,35.24 34.54,35.31 | RN4.1 39.94,35.18 | RN4.1 | 39.94,37.81 39.94,37.85 | 39.91,37.81 39.94,37.81 | RN4.1 RN4.4 | 39.94,37.81 RN4.1 | U4.3 78.79,39.17
  Top 0.406: 27.13,14.73 25.91,14.73 | 25.91,14.73 25.6,14.73 v25.6,15.54 | 25.91,14.73 23.62,14.73 | RN1.3 31.18,35.24 31.24,35.31 31.75,35.31 31.81,35.24 RN1.2 32.45,35.24 32.51,35.31 32.57,35.24 RN1.1 | RN4.1 39.89,35.29 39.88,35.31 39.86,35.29 RN4.2 39.13,35.29 39.12,35.31 39.1,35.29 RN4.3 38.35,35.31 38.34,35.29 RN4.4 | RN2.2 21.34,22.35 21.28,22.41 RN2.1 | RN2.2 21.28,21.65 21.34,21.59 21.28,21.53 RN2.3 21.28,20.89 21.34,20.83 21.28,20.77 RN2.4 | 21.59,14.8 21.59,14.73 21.28,15.04 RN2.2 | 21.02,12.5 21.08,12.45 | 21.02,12.5 RN3.1 RN3.2 | 19.3,12.7 20.83,12.7 21.02,12.5 | RN3.2 21.02,11.74 21.08,11.68 | 21.04,10.96 21.08,10.92 | 21.04,10.96 RN3.3 21.02,10.22 21.08,10.16 | RN3.2 21.02,10.98 21.04,10.96 | 21.08,10.16 | 21.08,10.16 RN3.4 | 40.39,26.92 40.39,29.72 v39.37,30.73 | 33.78,37.85 34.54,37.78 34.54,35.31 v34.54,33.53 | RN5.4 54.83,19.84 54.86,19.81 54.86,19.05 RN5.3 54.83,18.32 54.86,18.29 54.86,18.28 RN5.2 54.83,17.56 54.86,17.53 | 54.86,17.53 54.83,17.5 RN5.1 | RN5.1 55.16,17.48 | 4.83,38.91 4.83,38.86 | C4.1 4.83,38.91 | 4.83,38.91 4.83,39.14 | 27.69,37.85 27.69,37.77 27.69,35.81 | 58.67,15.49 57.66,15.49 55.69,17.46 54.86,17.53 | 54.86,17.53 RN5.1 | C11.1 77.54,37.91 78.79,39.17 | 74.68,35.05 C10.1 | 74.68,35.05 74.42,34.8 72.9,34.8 72.9,31.24 73.66,30.48 C1.1 76.01,27.87 76.2,27.69 R15.2 | C11.1 74.68,38.1 | C11.1 74.68,35.05
  Top 0.61: 39.88,37.78 40.45,37.78 42.93,35.31 C15.1 45.65,35.24 45.72,35.31 C6.1 | 60.72,8.87 60.71,8.89 | 60.72,8.87 C14.1 60.76,12.4 60.72,12.43 | 60.72,8.87 60.77,8.82 60.77,3.11 59.44,1.52 19.3,1.52 12.95,1.52 7.37,7.11 VPOS.P$1 | 60.72,12.43 60.71,12.45 | 60.72,12.43 R5.1 | U1.20 58.75,15.57 58.67,15.49 60.76,13.41 R5.1 | R5.1 60.76,11.63 61.47,10.92 70.87,10.92 | ISP1.2 77.22,14.22 74.93,14.22 73.33,12.63 73.33,11.1 73.15,10.92 70.87,10.92 | C4.1 7.32,38.91 7.4,38.83 U3.5 7.4,39.66 7.87,40.13 | R3.1 27.69,35.81 27.43,35.56 | C5.1 18.29,29.72 18.54,29.97 18.54,25.91 | 18.54,37.34 18.87,36.5 C9.+ 21.59,37.08 22.1,37.59 24.38,37.59 24.56,37.77 27.69,37.77 29.7,37.77 29.72,37.78 34.54,37.78 39.88,37.78 | 39.88,37.78 | 70.87,10.92 71.12,10.92 71.63,11.43 71.63,12.7 71.61,12.68 R14.2
  Top 0.813: 19.3,1.52 19.3,12.19 | 19.3,12.19 19.3,12.7 | 18.54,36.07 18.54,29.97 18.54,25.91 17.53,24.64 17.53,14.48 19.3,12.19
  Top 1.016: v26.52,19.05 26.52,23.16 | 27.69,23.62 29.21,23.62 | C7.1 21.59,14.8 21.4,14.8 19.3,12.7 | 7.87,40.13 16.26,40.13 18.54,37.85 18.54,37.34 18.54,36.07
  Bottom 0.254: ISP1.2 78.94,13.41
  Bottom 0.406: v25.6,15.54 26.52,15.54 | 78.94,13.41 78.94,21.03 80.16,22.25 80.16,38.71 79.15,38.71 78.74,39.12 78.79,39.17 U4.3 | v39.37,30.73 36.32,33.53 v34.54,33.53
  Bottom 1.016: 26.52,15.54 v26.52,19.05
VIN  (via drill 0.61)
  Top 0.254: U3.1 7.37,36.03
  Top 0.406: 9.4,34.54 9.4,34.6 | 9.4,34.6 9.4,36.32 9.3,36.22 U3.3 9.3,34.6 9,34.3 7.2,34.3 | 9.4,34.6 | 7.2,34.3 7.18,34.28 C2.1 | 7.2,34.3 7.2,35.1 7.4,35.3 U3.1
  Top 0.61: 9.4,34.54 9.4,33.9 9.4,33.2 v10.71,31.42
  Bottom 0.813: J0.PIN_3 9.46,11.23 12.7,16.76 12.7,30.7 v10.71,31.42

### Text on the board
Bottom: www.ps3toothfairy.com | 08:16
tPlace: TF-01-C | TIP | ps3toothfairy
dxf: END PANEL
tDocu: 22 | 12 | 11 | 23 | 1 | 33 | 34 | 44 | 28 | 1